# EAGLE schematic Tube_board_v3 (EAGLE 6.5.0)
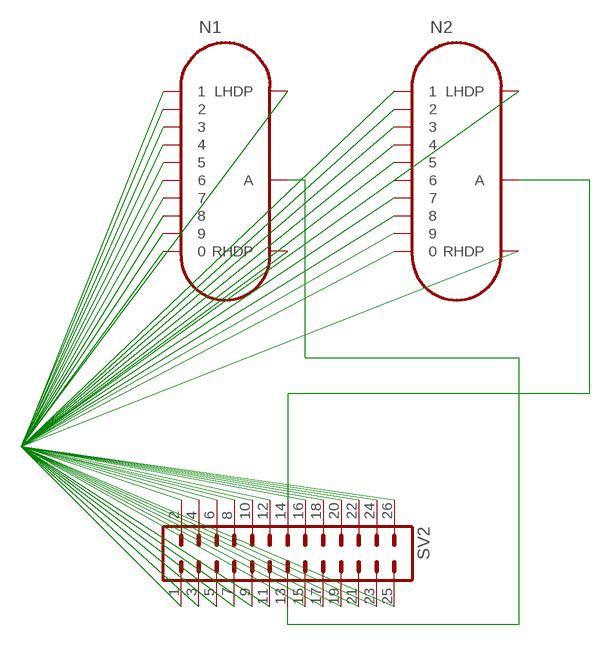
[diagram p0: schematic, sheet 1]

## Parts
N1  IN-14  [IN-14]
N2  IN-14  [IN-14]
SV2  MA13-2  [MA13-2]

## Nets
N$1: N1.A SV2.13
N$2: N2.A SV2.14
N$3: N1.0 N1.1 N1.2 N1.3 N1.4 N1.5 N1.6 N1.7 N1.8 N1.9 N1.LHDP N1.RHDP N2.0 N2.1 N2.2 N2.3 N2.4 N2.5 N2.6 N2.7 N2.8 N2.9 N2.LHDP N2.RHDP SV2.1 SV2.2 SV2.3 SV2.4 SV2.5 SV2.6 SV2.7 SV2.8 SV2.9 SV2.10 SV2.11 SV2.12 SV2.15 SV2.16 SV2.17 SV2.18 SV2.19 SV2.20 SV2.21 SV2.22 SV2.23 SV2.24 SV2.25 SV2.26

## Library data of the parts
N1 N2 = russian-nixies:IN-14: IN-14: medium numeric frontview nixie tube
SV2 = con-lstb:MA13-2: PIN HEADER; OC_FARNELL: unknown; OC_NEWARK: unknown

## Net classes
0 default: width 0.051 mm, clearance 0.205 mm